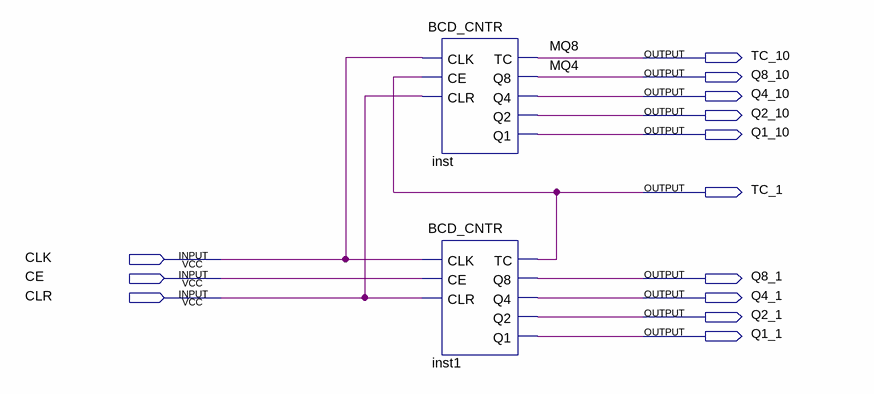
[diagram p0: schematic sheet]
// Quartus schematic cntr_test.bdf as structural Verilog: 2 symbols, 13 pins
module cntr_test (
  input  CLK,
  input  CE,
  input  CLR,
  output TC_10,
  output Q8_10,
  output Q4_10,
  output Q2_10,
  output Q1_10,
  output TC_1,
  output Q8_1,
  output Q4_1,
  output Q2_1,
  output Q1_1
);

  BCD_CNTR inst (.CLK(CLK), .CE(TC_1), .CLR(CLR), .TC(TC_10), .Q8(Q8_10), .Q4(Q4_10), .Q2(Q2_10), .Q1(Q1_10));
  BCD_CNTR inst1 (.CLK(CLK), .CE(CE), .CLR(CLR), .TC(TC_1), .Q8(Q8_1), .Q4(Q4_1), .Q2(Q2_1), .Q1(Q1_1));

  // Other names for the same wires on the sheet: MQ4 = Q8_10; MQ8 = TC_10
endmodule
